# Altium schematic sheet LT1962Room.SchDoc
size Letter
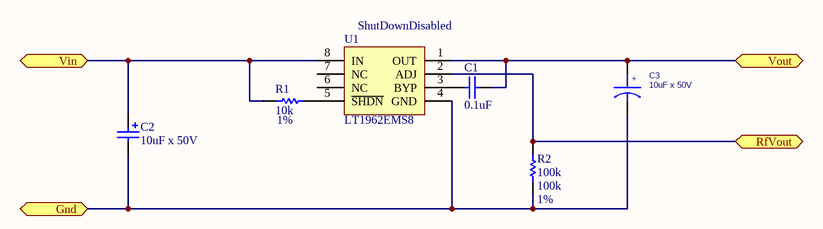
[diagram p0: LT1962Room.SchDoc]

## Parts
C1  0.1uF  [0805]
C2  10uF x 50V  [CC4532-1812]
C3  10uF x 50V  [TANTA]
R1  10k  Param: 1%  [0805]
R2  100k  Param: 1%  [0805]
U1  LT1962EMS8  [MSOP-8]

## Ports
Gnd, RfVout, Vin, Vout

## Nets
Gnd: C2.2 C3.2 R2.1 U1.4(GND) ; port Gnd
RfVout: R2.2 U1.2(ADJ) ; port RfVout
Vin: C2.1 R1.2 U1.8(IN) ; port Vin
Vout: C1.2 C3.1 U1.1(OUT) ; port Vout
NetC1_1: C1.1 U1.3(BYP)
NetR1_1: R1.1 U1.5(~{SHDN})

Not connected (* = marked no-connect by the designer): U1 6(NC) 7(NC)

## Notes on the sheet
- (near U1) ShutDownDisabled
- (in symbol CAP_POL) +

## Library data of the parts
C1 = Cap0603: Capacitor, Ceramic, 0603; TechInf: *; Param1: *; Footprint: 0603
C2 = Cap Pol3: CAP POL C4532X5R1C336M; Published: 8-Jun-2000; LatestRevisionDate: 17-Jul-2002; LatestRevisionNote: Re-released for DXP Platform.; PackageReference: C0805; Publisher: Altium Limited
C3 = CAP_POL: COMPFIXED: NO; COMPGROUP: 0; COMPHEIGHT: 0.000; COMPLOC: [1523.633,1584.000]; COMPROT: 90; COMPSIDE: TOP; COMPKEY: NO; COMPLOCKED: NO; DECOUPLER: NO; MEMORY: NO
R1 R2 = Res0603: Resistor; Param1: 100ppm/C; TechInfo: *
  R1: Value: 10k
  R2: Value: 100k
U1 = LT1962EMS8: micropower, low noise, low  dropout regulator; Footprint: *; Thechinf: LT1962EMS8